# Altium project MAX77857.PrjPcb
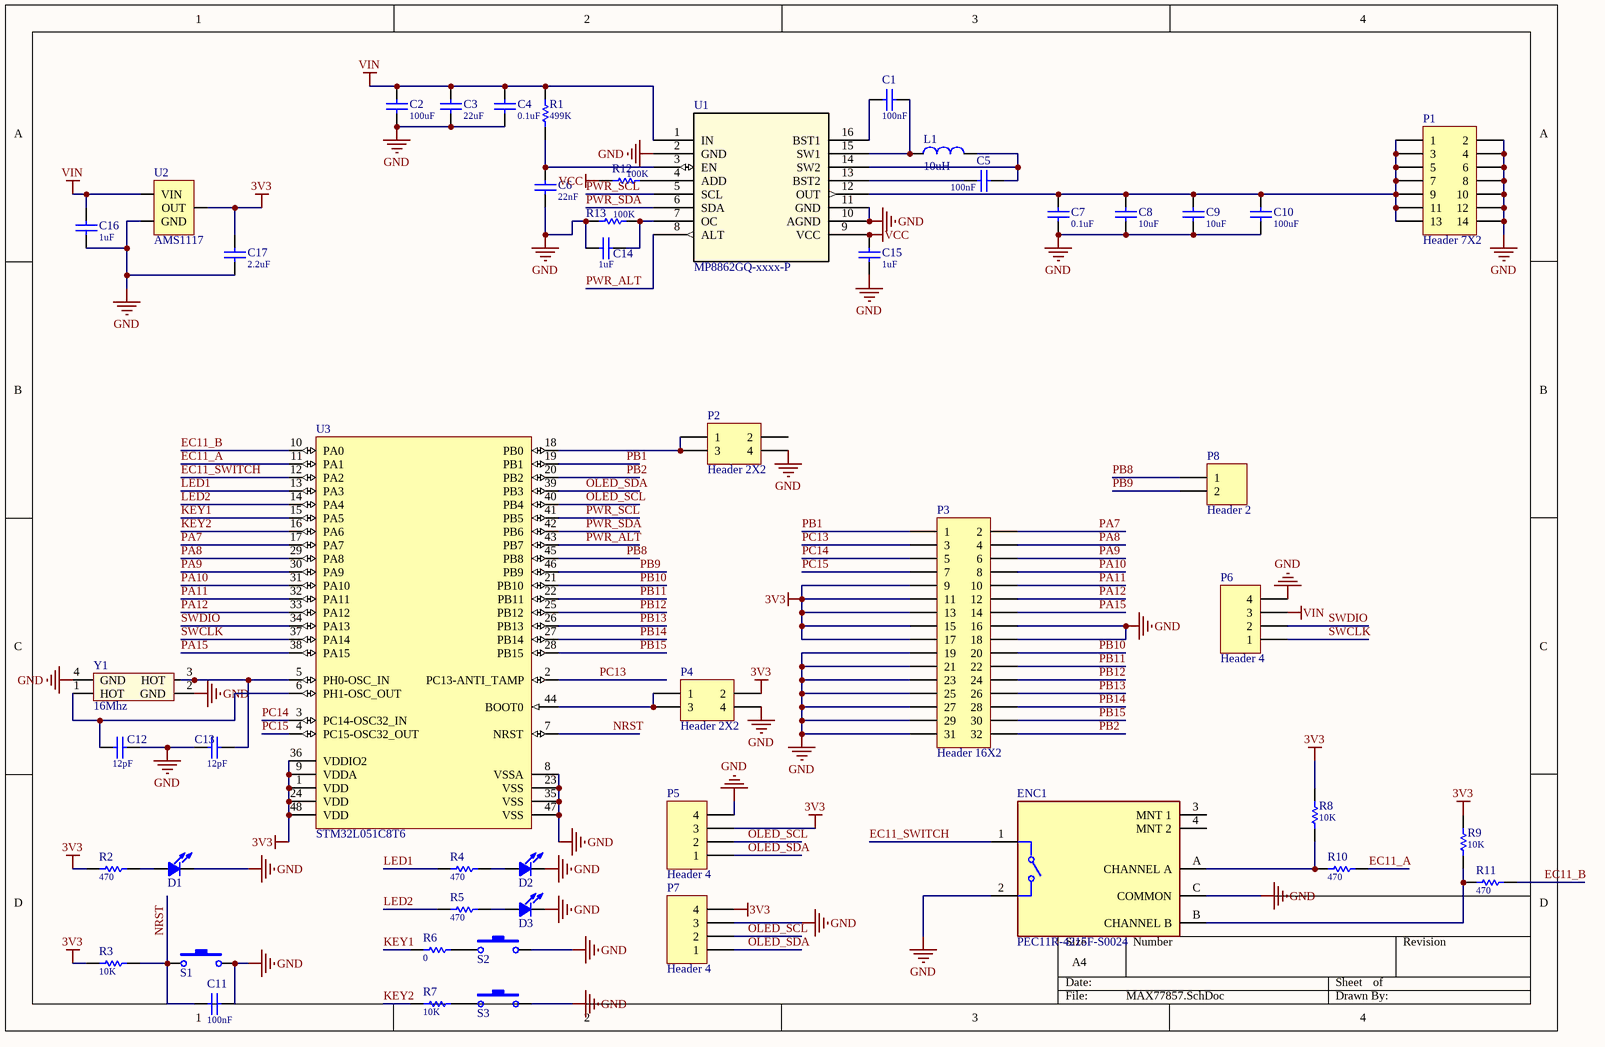
[diagram p0: MAX77857.SchDoc]
1 sheet, 50 parts. Net scope: global (net labels, ports and power ports of the same name join across sheets).
Board file: MAX77857.PcbDoc

## Sheet MAX77857.SchDoc
size A4; SheetNumber: 1; SheetTotal: 1

### Parts
C1  value 100nF  [C0603-L]  (hidden comment: Cap-S)
C2  value 100uF  [C1206-L]  (hidden comment: Cap-S)
C3  value 22uF  [C0603-L]  (hidden comment: Cap-S)
C4  value 0.1uF  [C0603-L]  (hidden comment: Cap-S)
C5  value 100nF  [C0603-L]  (hidden comment: Cap-S)
C6  value 22nF  [C0603-L]  (hidden comment: Cap-S)
C7  value 0.1uF  [C0603-L]  (hidden comment: Cap-S)
C8  value 10uF  [C1206-L]  (hidden comment: Cap-S)
C9  value 10uF  [C1206-L]  (hidden comment: Cap-S)
C10  value 100uF  [C1206-L]  (hidden comment: Cap-S)
C11  value 100nF  [C0603-L]  (hidden comment: Cap-S)
C12  value 12pF  [C0603-L]  (hidden comment: Cap-S)
C13  value 12pF  [C0603-L]  (hidden comment: Cap-S)
C14  value 1uF  [C0603-L]  (hidden comment: Cap-S)
C15  value 1uF  [C0603-L]  (hidden comment: Cap-S)
C16  value 1uF  [C1206-L]  (hidden comment: Cap-S)
C17  value 2.2uF  [C0603-L]  (hidden comment: Cap-S)
D1  LED  [Led-0805_L]  (value not drawn)
D2  LED  [Led-0805_L]  (value not drawn)
D3  LED  [Led-0805_L]  (value not drawn)
ENC1  PEC11R-4215F-S0024  [FP-PEC11R-4215F-S0024-MFG]
L1  10uH  [L-6.5mm]
P1  Header 7X2  [HDR2X7]
P2  Header 2X2  [HDR2X2]
P3  Header 16X2  [HDR2X16]
P4  Header 2X2  [HDR2X2]
P5  Header 4  [HDR1X4]
P6  Header 4  [HDR1X4]
P7  Header 4  [HDR1X4]
P8  Header 2  [HDR1X2]
R1  value 499K  [R0603-L]  (hidden comment: R)
R2  value 470  [R0603-L]  (hidden comment: R)
R3  value 10K  [R0603-L]  (hidden comment: R)
R4  value 470  [R0603-L]  (hidden comment: R)
R5  value 470  [R0603-L]  (hidden comment: R)
R6  value 0  [R0603-L]  (hidden comment: R)
R7  value 10K  [R0603-L]  (hidden comment: R)
R8  value 10K  [R0603-L]  (hidden comment: R)
R9  value 10K  [R0603-L]  (hidden comment: R)
R10  value 470  [R0603-L]  (hidden comment: R)
R11  value 470  [R0603-L]  (hidden comment: R)
R12  value 100K  [R0603-L]  (hidden comment: R)
R13  value 100K  [R0603-L]  (hidden comment: R)
S1  SW-PB2  [SW-PB2-SMD]  (value not drawn)
S2  SW-PB2  [SW-PB2-SMD]  (value not drawn)
S3  SW-PB2  [SW-PB2-SMD]  (value not drawn)
U1  MP8862GQ-xxxx-P  [QFN-3x3_MP8862_MNP]
U2  AMS1117  [SOT-223]
U3  STM32L051C8T6  [STM-LQFP48_L]
Y1  16Mhz  [XTAL3225]

### Nets
3V3: C17.2 P3.9 P3.11 P3.13 P3.15 P3.17 P4.2 P5.3 P7.4 R2.2 R3.2 R8.2 R9.2 U2.2(OUT) U3.1(VDD) U3.9(VDDA) U3.24(VDD) U3.36(VDDIO2) U3.48(VDD)
GND: C2.1 C3.1 C4.2 C6.2 C7.1 C8.1 C9.1 C10.1 C11.2 C12.1 C13.2 C14.1 C15.2 C16.1 C17.1 D1.2 D2.2 D3.2 ENC1.2 ENC1.C(COMMON) P1.2 P1.4 P1.6 P1.8 P1.10 P1.12 P1.14 P2.4 P3.16 P3.18 P3.19 P3.21 P3.23 P3.25 P3.27 P3.29 P3.31 P4.4 P5.4 P6.4 P7.3 R13.2 S1.2 S2.2 S3.2 U1.2(GND) U1.10(AGND) U1.11(GND) U2.1(GND) U3.8(VSSA) U3.23(VSS) U3.35(VSS) U3.47(VSS) Y1.2(GND) Y1.4(GND)
VCC: C15.1 R12.2 U1.9(VCC)
VIN: C2.2 C3.2 C4.1 C16.2 P6.3 R1.2 U1.1(IN) U2.3(VIN)
EC11_A: R10.2 U3.11(PA1)
EC11_B: R11.2 U3.10(PA0)
EC11_SWITCH: ENC1.1 U3.12(PA2)
KEY1: R6.2 U3.15(PA5)
KEY2: R7.2 U3.16(PA6)
LED1: R4.2 U3.13(PA3)
LED2: R5.2 U3.14(PA4)
NRST: C11.1 R3.1 S1.1 U3.7(NRST)
OLED_SCL: P5.2 P7.2 U3.40(PB4)
OLED_SDA: P5.1 P7.1 U3.39(PB3)
PA7: P3.2 U3.17(PA7)
PA8: P3.4 U3.29(PA8)
PA9: P3.6 U3.30(PA9)
PA10: P3.8 U3.31(PA10)
PA11: P3.10 U3.32(PA11)
PA12: P3.12 U3.33(PA12)
PA15: P3.14 U3.38(PA15)
PB1: P3.1 U3.19(PB1)
PB2: P3.32 U3.20(PB2)
PB8: P8.1 U3.45(PB8)
PB9: P8.2 U3.46(PB9)
PB10: P3.20 U3.21(PB10)
PB11: P3.22 U3.22(PB11)
PB12: P3.24 U3.25(PB12)
PB13: P3.26 U3.26(PB13)
PB14: P3.28 U3.27(PB14)
PB15: P3.30 U3.28(PB15)
PC13: P3.3 U3.2(PC13-ANTI_TAMP)
PC14: P3.5 U3.3(PC14-OSC32_IN)
PC15: P3.7 U3.4(PC15-OSC32_OUT)
PWR_ALT: U1.8(ALT) U3.43(PB7)
PWR_SCL: U1.5(SCL) U3.41(PB5)
PWR_SDA: U1.6(SDA) U3.42(PB6)
SWCLK: P6.1 U3.37(PA14)
SWDIO: P6.2 U3.34(PA13)
NetC1_1: C1.1 U1.16(BST1)
NetC1_2: C1.2 L1.1 U1.15(SW1)
NetC5_1: C5.1 U1.13(BST2)
NetC5_2: C5.2 L1.2 U1.14(SW2)
NetC6_1: C6.1 R1.1 U1.3(EN)
NetC7_2: C7.2 C8.2 C9.2 C10.2 P1.1 P1.3 P1.5 P1.7 P1.9 P1.11 P1.13 U1.12(OUT)
NetC12_2: C12.2 U3.6(PH1-OSC_OUT) Y1.1(HOT)
NetC13_1: C13.1 U3.5(PH0-OSC_IN) Y1.3(HOT)
NetC14_2: C14.2 R13.1 U1.7(OC)
NetD1_1: D1.1 R2.1
NetD2_1: D2.1 R4.1
NetD3_1: D3.1 R5.1
NetENC1_A: ENC1.A(CHANNEL_A) R8.1 R10.1
NetENC1_B: ENC1.B(CHANNEL_B) R9.1 R11.1
NetP2_1: P2.1 P2.3 U3.18(PB0)
NetP4_1: P4.1 P4.3 U3.44(BOOT0)
NetR6_1: R6.1 S2.1
NetR7_1: R7.1 S3.1
NetR12_1: R12.1 U1.4(ADD)

Not connected (* = marked no-connect by the designer): ENC1 3(MNT_1) 4(MNT_2); P2 2

### Library data of the parts
C1-C17 = Cap-S: 贴片瓷片电容
D1-D3 = LED: 发光二极管
ENC1 = CMP-1747-00012-2: ROTARY ENCODER MECHANICAL 24PPR; Hole Diameter: 1.8mm; Output Type: Quadrature; Pulses per Revolution: 24; Number of Channels: 2; Built in Switch: Yes; Min Operating Temperature: -30°C; Series: PEC11R; Type: Mechanical; Package Quantity: 150; Length: 21.5mm; Max Operating Temperature: 70°C; Encoder Type: Mechanical; Height: 13.4mm; Detent: Yes; Packaging: Bulk; Orientation: Vertical; Width: 12.5mm; Termination: PC Pins; Mount: Through Hole; REACH SVHC: No SVHC; Radiation Hardening: No; RoHS Compliant: Yes
L1 = Inductor
P1 = Header 7X2: Header, 7-Pin, Dual row; LatestRevisionDate: 17-Jul-2002; LatestRevisionNote: Re-released for DXP Platform.; Publisher: Altium Limited
P2 P4 = Header 2X2: Header, 2-Pin, Dual row; LatestRevisionDate: 17-Jul-2002; LatestRevisionNote: Re-released for DXP Platform.; Publisher: Altium Limited
P3 = Header 16X2: Header, 16-Pin, Dual row; LatestRevisionDate: 17-Jul-2002; LatestRevisionNote: Re-released for DXP Platform.; Publisher: Altium Limited
P5-P7 = Header 4: Header, 4-Pin; LatestRevisionDate: 17-Jul-2002; LatestRevisionNote: Re-released for DXP Platform.; Publisher: Altium Limited
P8 = Header 2: Header, 2-Pin; LatestRevisionDate: 17-Jul-2002; LatestRevisionNote: Re-released for DXP Platform.; Publisher: Altium Limited
R1-R13 = Res: 贴片电阻
S1-S3 = SW-PB2: 贴片式2脚微动开关
U1 = MP8862GQ-xxxx-P: No Description Available; Mfr_Name: Monolithic Power Systems; RefDes: RefDes; Type: Type
U3 = CMP-1546-00003-1: Ultra-Low-Power ARM Cortex-M0+ MCU, 64 KB Flash, 1.8 to 3.6 V, -40 to 85 degC, 48-Pin LQFP, RoHS, Tray; RAM: 8 KB; Flash: 64 KB; Data EEPROM: 2 KB; VDD Max: 3.6 V; VDD Min: 1.8 V; PartNumber: STM32L051C8T6; ComponentLink3URL: http://www.st.com/st-web-ui/static/active/en/resource/technical/document/datasheet/DM00058181.pdf; ComponentLink1URL: http://www.st.com/web/en/home.html; Temperature Min: -40 degC; DatasheetVersion: Rev. 4; ComponentLink3Description: Package Specification; Mounting Technology: Surface Mount; ComponentLink1Description: Manufacturer URL; Packing: Tray; Temperature Max: 85 degC; ComponentLink2URL: http://www.st.com/st-web-ui/static/active/en/resource/technical/document/datasheet/DM00108219.pdf; PackageDescription: 48-Pin Frame Chip Scale Package, Body 7 x 7 mm, Pitch 0.5 mm; ComponentLink2Description: Datasheet; RoHS: TRUE
Y1 = XTAL_3225: 3225贴片无源晶振